# Altium schematic sheet 03 SOC_PORT0~2.SchDoc
size 513 x 386 mm
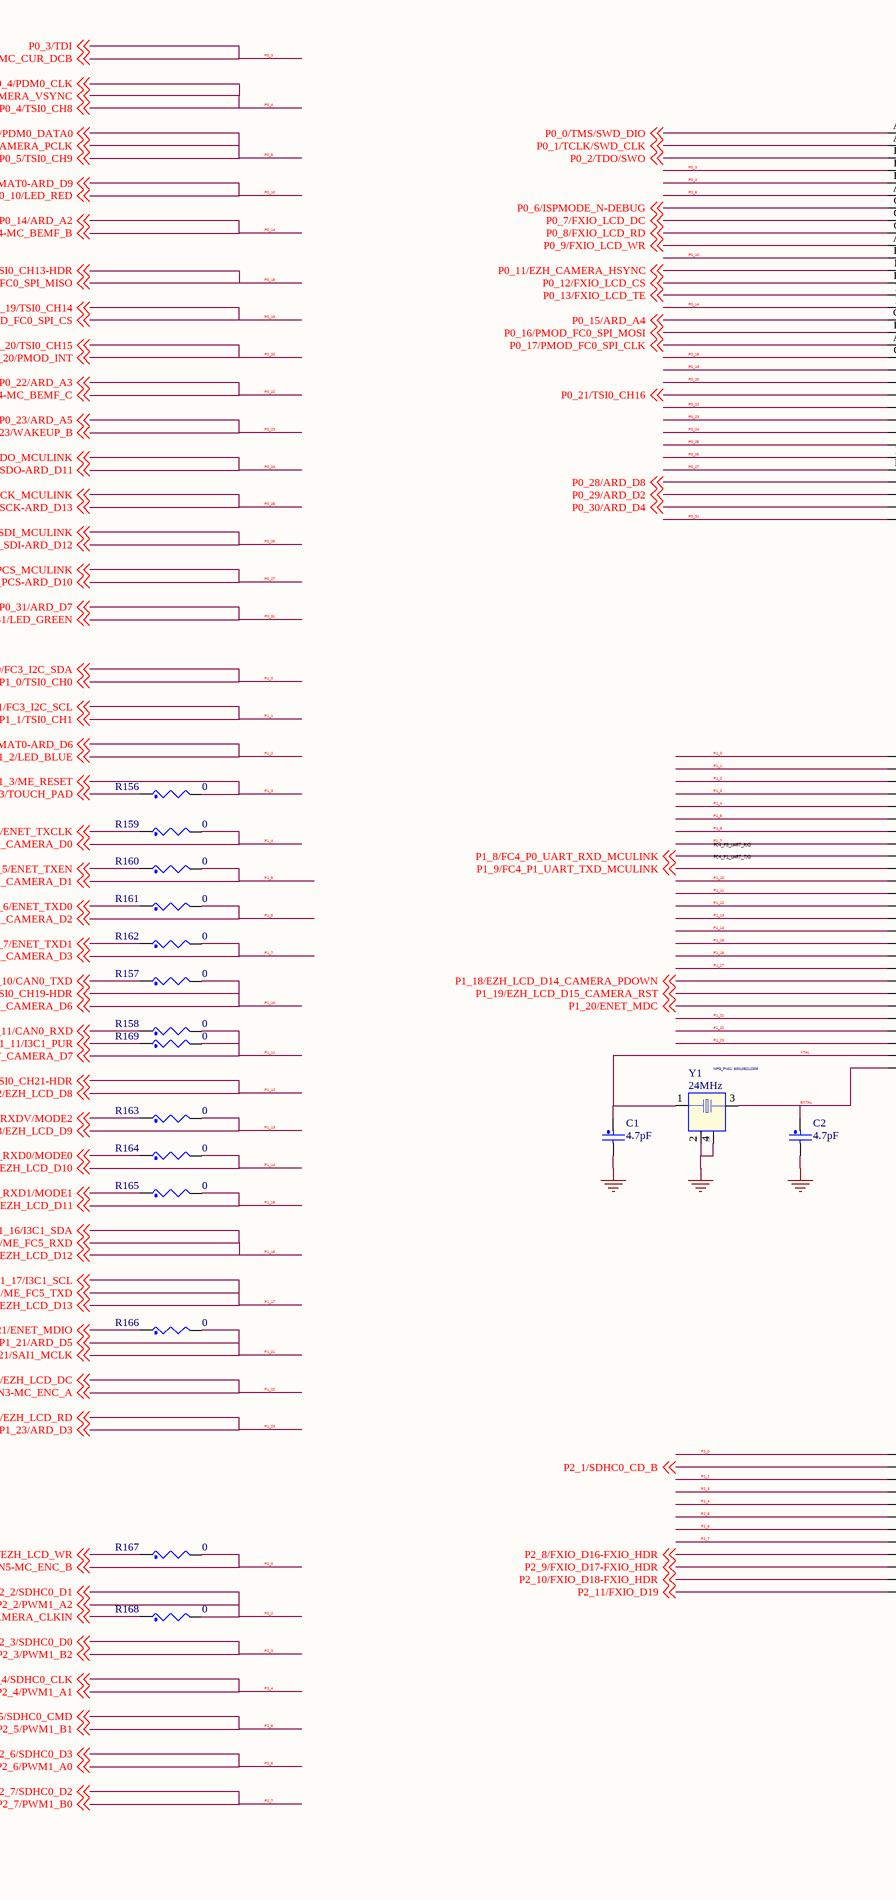
[diagram p0: 03 SOC_PORT0~2.SchDoc, left]
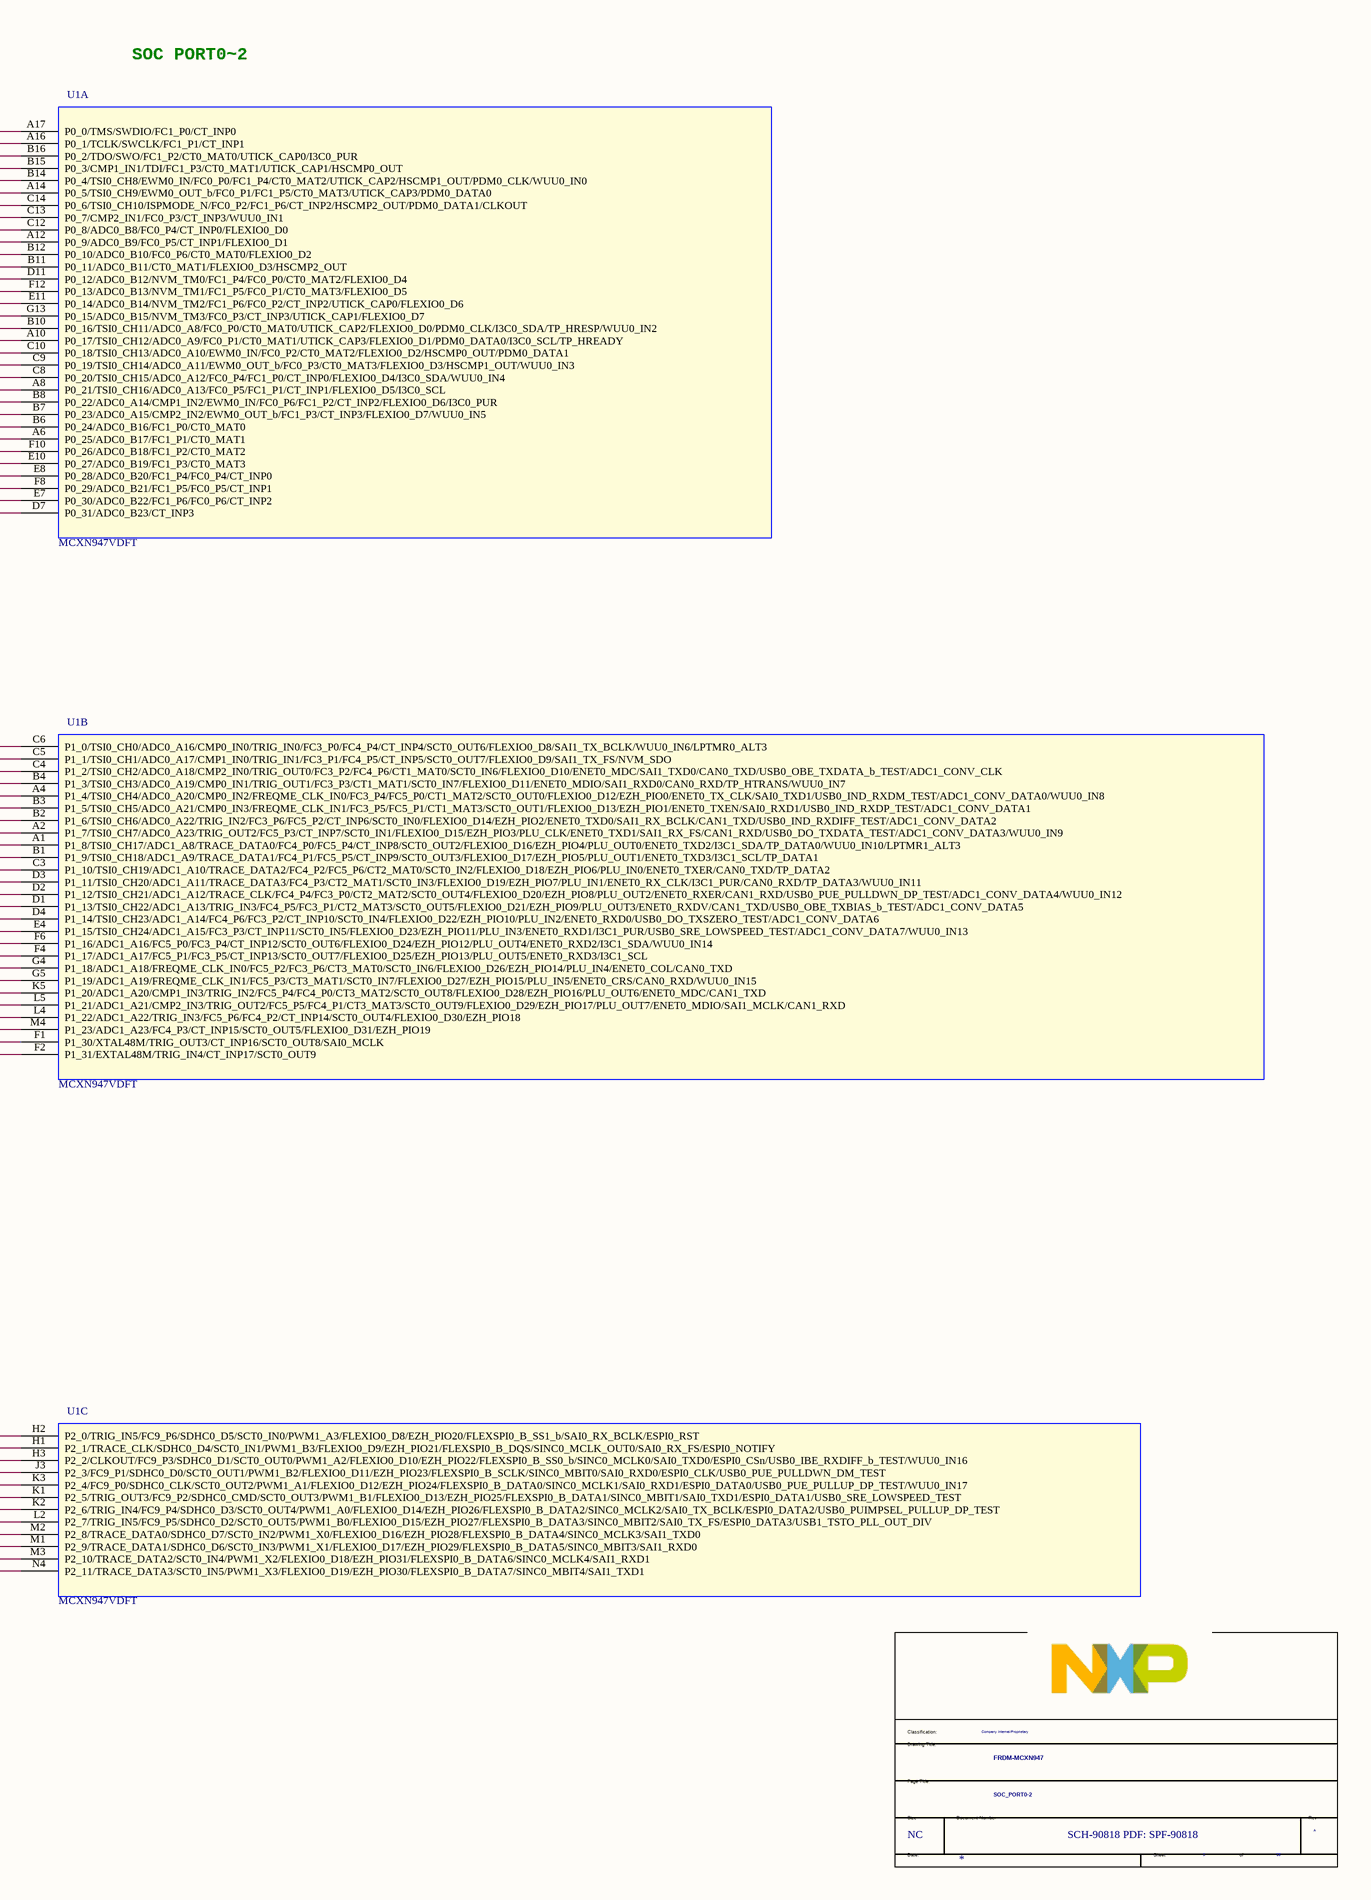
[diagram p1: 03 SOC_PORT0~2.SchDoc, right]

## Parts
*  Doc: SCH-90818 PDF: SPF-90818  RevCode: A  Title: FRDM-MCXN947  Page Size: NC  Page Number: 3  Page Count: 13  PageTitle: SOC_PORT0-2  Classification: Company Internal/Proprietary  (hidden comment: TitleBlock_FS)  (graphical)
C1  4.7pF  [CC0402_25]
C2  4.7pF  [CC0402_25]
R156  0  [RC0603_OV]
R157  0  [RC0603_OV]
R158  0  [RC0603_OV]
R159  0  [RC0603_OV]
R160  0  [RC0603_OV]
R161  0  [RC0603_OV]
R162  0  [RC0603_OV]
R163  0  [RC0603_OV]
R164  0  [RC0603_OV]
R165  0  [RC0603_OV]
R166  0  [RC0603_OV]
R167  0  [RC0402_25]
R168  0  [RC0603_OV]
R169  0  [RC0402_25]
U1  MCXN947VDFT  [bga184_0p5_9x9_sm]  (parts A,B,C of 8)
Y1  24MHz  MFG_PN01: 830108212309  [xtal4_2p1x1p7mm_sm]

## Nets
GND: C1.2 C2.2 Y1.2(GND1) Y1.4(GND2)
EXTAL: C2.1 U1.F2(P1_31/EXTAL48M/TRIG_IN4/CT_INP17/SCT0_OUT9) Y1.3
P0_0/TMS/SWD_DIO: U1.A17(P0_0/TMS/SWDIO/FC1_P0/CT_INP0) ; off-sheet P0_0/TMS/SWD_DIO
P0_1/TCLK/SWD_CLK: U1.A16(P0_1/TCLK/SWCLK/FC1_P1/CT_INP1) ; off-sheet P0_1/TCLK/SWD_CLK
P0_2/TDO/SWO: U1.B16(P0_2/TDO/SWO/FC1_P2/CT0_MAT0/UTICK_CAP0/I3C0_PUR) ; off-sheet P0_2/TDO/SWO
P0_3: U1.B15(P0_3/CMP1_IN1/TDI/FC1_P3/CT0_MAT1/UTICK_CAP1/HSCMP0_OUT) ; off-sheet P0_3/CMP1_IN1-MC_CUR_DCB, off-sheet P0_3/TDI  [also labelled P0_3/CMP1_IN1-MC_CUR_DCB, P0_3/TDI]
P0_4: U1.B14(P0_4/TSI0_CH8/EWM0_IN/FC0_P0/FC1_P4/CT0_MAT2/UTICK_CAP2/HSCMP1_OUT/PDM0_CLK/WUU0_IN0) ; off-sheet P0_4/TSI0_CH8, off-sheet P0_4/PDM0_CLK, off-sheet P0_4/EZH_CAMERA_VSYNC  [also labelled P0_4/EZH_CAMERA_VSYNC, P0_4/PDM0_CLK, P0_4/TSI0_CH8]
P0_5: U1.A14(P0_5/TSI0_CH9/EWM0_OUT_b/FC0_P1/FC1_P5/CT0_MAT3/UTICK_CAP3/PDM0_DATA0) ; off-sheet P0_5/EZH_CAMERA_PCLK, off-sheet P0_5/PDM0_DATA0, off-sheet P0_5/TSI0_CH9  [also labelled P0_5/EZH_CAMERA_PCLK, P0_5/PDM0_DATA0, P0_5/TSI0_CH9]
P0_6/ISPMODE_N-DEBUG: U1.C14(P0_6/TSI0_CH10/ISPMODE_N/FC0_P2/FC1_P6/CT_INP2/HSCMP2_OUT/PDM0_DATA1/CLKOUT) ; off-sheet P0_6/ISPMODE_N-DEBUG
P0_7/FXIO_LCD_DC: U1.C13(P0_7/CMP2_IN1/FC0_P3/CT_INP3/WUU0_IN1) ; off-sheet P0_7/FXIO_LCD_DC
P0_8/FXIO_LCD_RD: U1.C12(P0_8/ADC0_B8/FC0_P4/CT_INP0/FLEXIO0_D0) ; off-sheet P0_8/FXIO_LCD_RD
P0_9/FXIO_LCD_WR: U1.A12(P0_9/ADC0_B9/FC0_P5/CT_INP1/FLEXIO0_D1) ; off-sheet P0_9/FXIO_LCD_WR
P0_10: U1.B12(P0_10/ADC0_B10/FC0_P6/CT0_MAT0/FLEXIO0_D2) ; off-sheet P0_10/LED_RED, off-sheet P0_10/CT0_MAT0-ARD_D9  [also labelled P0_10/CT0_MAT0-ARD_D9, P0_10/LED_RED]
P0_11/EZH_CAMERA_HSYNC: U1.B11(P0_11/ADC0_B11/CT0_MAT1/FLEXIO0_D3/HSCMP2_OUT) ; off-sheet P0_11/EZH_CAMERA_HSYNC
P0_12/FXIO_LCD_CS: U1.D11(P0_12/ADC0_B12/NVM_TM0/FC1_P4/FC0_P0/CT0_MAT2/FLEXIO0_D4) ; off-sheet P0_12/FXIO_LCD_CS
P0_13/FXIO_LCD_TE: U1.F12(P0_13/ADC0_B13/NVM_TM1/FC1_P5/FC0_P1/CT0_MAT3/FLEXIO0_D5) ; off-sheet P0_13/FXIO_LCD_TE
P0_14: U1.E11(P0_14/ADC0_B14/NVM_TM2/FC1_P6/FC0_P2/CT_INP2/UTICK_CAP0/FLEXIO0_D6) ; off-sheet P0_14/ARD_A2, off-sheet P0_14/ADC0_B14-MC_BEMF_B  [also labelled P0_14/ADC0_B14-MC_BEMF_B, P0_14/ARD_A2]
P0_15/ARD_A4: U1.G13(P0_15/ADC0_B15/NVM_TM3/FC0_P3/CT_INP3/UTICK_CAP1/FLEXIO0_D7) ; off-sheet P0_15/ARD_A4
P0_16/PMOD_FC0_SPI_MOSI: U1.B10(P0_16/TSI0_CH11/ADC0_A8/FC0_P0/CT0_MAT0/UTICK_CAP2/FLEXIO0_D0/PDM0_CLK/I3C0_SDA/TP_HRESP/WUU0_IN2) ; off-sheet P0_16/PMOD_FC0_SPI_MOSI
P0_17/PMOD_FC0_SPI_CLK: U1.A10(P0_17/TSI0_CH12/ADC0_A9/FC0_P1/CT0_MAT1/UTICK_CAP3/FLEXIO0_D1/PDM0_DATA0/I3C0_SCL/TP_HREADY) ; off-sheet P0_17/PMOD_FC0_SPI_CLK
P0_18: U1.C10(P0_18/TSI0_CH13/ADC0_A10/EWM0_IN/FC0_P2/CT0_MAT2/FLEXIO0_D2/HSCMP0_OUT/PDM0_DATA1) ; off-sheet P0_18/TSI0_CH13-HDR, off-sheet P0_18/PMOD_FC0_SPI_MISO  [also labelled P0_18/PMOD_FC0_SPI_MISO, P0_18/TSI0_CH13-HDR]
P0_19: U1.C9(P0_19/TSI0_CH14/ADC0_A11/EWM0_OUT_b/FC0_P3/CT0_MAT3/FLEXIO0_D3/HSCMP1_OUT/WUU0_IN3) ; off-sheet P0_19/TSI0_CH14, off-sheet P0_19/PMOD_FC0_SPI_CS  [also labelled P0_19/PMOD_FC0_SPI_CS, P0_19/TSI0_CH14]
P0_20: U1.C8(P0_20/TSI0_CH15/ADC0_A12/FC0_P4/FC1_P0/CT_INP0/FLEXIO0_D4/I3C0_SDA/WUU0_IN4) ; off-sheet P0_20/TSI0_CH15, off-sheet P0_20/PMOD_INT  [also labelled P0_20/PMOD_INT, P0_20/TSI0_CH15]
P0_21/TSI0_CH16: U1.A8(P0_21/TSI0_CH16/ADC0_A13/FC0_P5/FC1_P1/CT_INP1/FLEXIO0_D5/I3C0_SCL) ; off-sheet P0_21/TSI0_CH16
P0_22: U1.B8(P0_22/ADC0_A14/CMP1_IN2/EWM0_IN/FC0_P6/FC1_P2/CT_INP2/FLEXIO0_D6/I3C0_PUR) ; off-sheet P0_22/ARD_A3, off-sheet P0_22/ADC0_A14-MC_BEMF_C  [also labelled P0_22/ADC0_A14-MC_BEMF_C, P0_22/ARD_A3]
P0_23: U1.B7(P0_23/ADC0_A15/CMP2_IN2/EWM0_OUT_b/FC1_P3/CT_INP3/FLEXIO0_D7/WUU0_IN5) ; off-sheet P0_23/WAKEUP_B, off-sheet P0_23/ARD_A5  [also labelled P0_23/ARD_A5, P0_23/WAKEUP_B]
P0_24: U1.B6(P0_24/ADC0_B16/FC1_P0/CT0_MAT0) ; off-sheet P0_24/FC1_SPI_SDO_MCULINK, off-sheet P0_24/FC1_SPI_SDO-ARD_D11  [also labelled P0_24/FC1_SPI_SDO-ARD_D11, P0_24/FC1_SPI_SDO_MCULINK]
P0_25: U1.A6(P0_25/ADC0_B17/FC1_P1/CT0_MAT1) ; off-sheet P0_25/FCI_SPI_SCK_MCULINK, off-sheet P0_25/FCI_SPI_SCK-ARD_D13  [also labelled P0_25/FCI_SPI_SCK-ARD_D13, P0_25/FCI_SPI_SCK_MCULINK]
P0_26: U1.F10(P0_26/ADC0_B18/FC1_P2/CT0_MAT2) ; off-sheet P0_26/FC1_SPI_SDI_MCULINK, off-sheet P0_26/FC1_SPI_SDI-ARD_D12  [also labelled P0_26/FC1_SPI_SDI-ARD_D12, P0_26/FC1_SPI_SDI_MCULINK]
P0_27: U1.E10(P0_27/ADC0_B19/FC1_P3/CT0_MAT3) ; off-sheet P0_27/FC1_SPI_PCS_MCULINK, off-sheet P0_27/FC1_SPI_PCS-ARD_D10  [also labelled P0_27/FC1_SPI_PCS-ARD_D10, P0_27/FC1_SPI_PCS_MCULINK]
P0_28/ARD_D8: U1.E8(P0_28/ADC0_B20/FC1_P4/FC0_P4/CT_INP0) ; off-sheet P0_28/ARD_D8
P0_29/ARD_D2: U1.F8(P0_29/ADC0_B21/FC1_P5/FC0_P5/CT_INP1) ; off-sheet P0_29/ARD_D2
P0_30/ARD_D4: U1.E7(P0_30/ADC0_B22/FC1_P6/FC0_P6/CT_INP2) ; off-sheet P0_30/ARD_D4
P0_31: U1.D7(P0_31/ADC0_B23/CT_INP3) ; off-sheet P0_31/LED_GREEN, off-sheet P0_31/ARD_D7  [also labelled P0_31/ARD_D7, P0_31/LED_GREEN]
P1_0: U1.C6(P1_0/TSI0_CH0/ADC0_A16/CMP0_IN0/TRIG_IN0/FC3_P0/FC4_P4/CT_INP4/SCT0_OUT6/FLEXIO0_D8/SAI1_TX_BCLK/WUU0_IN6/LPTMR0_ALT3) ; off-sheet P1_0/FC3_I2C_SDA, off-sheet P1_0/TSI0_CH0  [also labelled P1_0/FC3_I2C_SDA, P1_0/TSI0_CH0]
P1_1: U1.C5(P1_1/TSI0_CH1/ADC0_A17/CMP1_IN0/TRIG_IN1/FC3_P1/FC4_P5/CT_INP5/SCT0_OUT7/FLEXIO0_D9/SAI1_TX_FS/NVM_SDO) ; off-sheet P1_1/FC3_I2C_SCL, off-sheet P1_1/TSI0_CH1  [also labelled P1_1/FC3_I2C_SCL, P1_1/TSI0_CH1]
P1_2: U1.C4(P1_2/TSI0_CH2/ADC0_A18/CMP2_IN0/TRIG_OUT0/FC3_P2/FC4_P6/CT1_MAT0/SCT0_IN6/FLEXIO0_D10/ENET0_MDC/SAI1_TXD0/CAN0_TXD/USB0_OBE_TXDATA_b_TEST/ADC1_CONV_CLK) ; off-sheet P1_2/LED_BLUE, off-sheet P1_2/CT1_MAT0-ARD_D6  [also labelled P1_2/CT1_MAT0-ARD_D6, P1_2/LED_BLUE]
P1_3: R156.2 U1.B4(P1_3/TSI0_CH3/ADC0_A19/CMP0_IN1/TRIG_OUT1/FC3_P3/CT1_MAT1/SCT0_IN7/FLEXIO0_D11/ENET0_MDIO/SAI1_RXD0/CAN0_RXD/TP_HTRANS/WUU0_IN7) ; off-sheet P1_3/ME_RESET  [also labelled P1_3/ME_RESET]
P1_3/TOUCH_PAD: R156.1 ; off-sheet P1_3/TOUCH_PAD
P1_4: R159.2 U1.A4(P1_4/TSI0_CH4/ADC0_A20/CMP0_IN2/FREQME_CLK_IN0/FC3_P4/FC5_P0/CT1_MAT2/SCT0_OUT0/FLEXIO0_D12/EZH_PIO0/ENET0_TX_CLK/SAI0_TXD1/USB0_IND_RXDM_TEST/ADC1_CONV_DATA0/WUU0_IN8) ; off-sheet P1_4/EZH_LCD_D0_CAMERA_D0  [also labelled P1_4/EZH_LCD_D0_CAMERA_D0]
P1_4/ENET_TXCLK: R159.1 ; off-sheet P1_4/ENET_TXCLK
P1_5: R160.2 U1.B3(P1_5/TSI0_CH5/ADC0_A21/CMP0_IN3/FREQME_CLK_IN1/FC3_P5/FC5_P1/CT1_MAT3/SCT0_OUT1/FLEXIO0_D13/EZH_PIO1/ENET0_TXEN/SAI0_RXD1/USB0_IND_RXDP_TEST/ADC1_CONV_DATA1) ; off-sheet P1_5/EZH_LCD_D1_CAMERA_D1  [also labelled P1_5/EZH_LCD_D1_CAMERA_D1]
P1_5/ENET_TXEN: R160.1 ; off-sheet P1_5/ENET_TXEN
P1_6: R161.2 U1.B2(P1_6/TSI0_CH6/ADC0_A22/TRIG_IN2/FC3_P6/FC5_P2/CT_INP6/SCT0_IN0/FLEXIO0_D14/EZH_PIO2/ENET0_TXD0/SAI1_RX_BCLK/CAN1_TXD/USB0_IND_RXDIFF_TEST/ADC1_CONV_DATA2) ; off-sheet P1_6/EZH_LCD_D2_CAMERA_D2  [also labelled P1_6/EZH_LCD_D2_CAMERA_D2]
P1_6/ENET_TXD0: R161.1 ; off-sheet P1_6/ENET_TXD0
P1_7: R162.2 U1.A2(P1_7/TSI0_CH7/ADC0_A23/TRIG_OUT2/FC5_P3/CT_INP7/SCT0_IN1/FLEXIO0_D15/EZH_PIO3/PLU_CLK/ENET0_TXD1/SAI1_RX_FS/CAN1_RXD/USB0_DO_TXDATA_TEST/ADC1_CONV_DATA3/WUU0_IN9) ; off-sheet P1_7/EZH_LCD_D3_CAMERA_D3  [also labelled P1_7/EZH_LCD_D3_CAMERA_D3]
P1_7/ENET_TXD1: R162.1 ; off-sheet P1_7/ENET_TXD1
P1_8/FC4_P0_UART_RXD_MCULINK: U1.A1(P1_8/TSI0_CH17/ADC1_A8/TRACE_DATA0/FC4_P0/FC5_P4/CT_INP8/SCT0_OUT2/FLEXIO0_D16/EZH_PIO4/PLU_OUT0/ENET0_TXD2/I3C1_SDA/TP_DATA0/WUU0_IN10/LPTMR1_ALT3) ; off-sheet P1_8/FC4_P0_UART_RXD_MCULINK
P1_9/FC4_P1_UART_TXD_MCULINK: U1.B1(P1_9/TSI0_CH18/ADC1_A9/TRACE_DATA1/FC4_P1/FC5_P5/CT_INP9/SCT0_OUT3/FLEXIO0_D17/EZH_PIO5/PLU_OUT1/ENET0_TXD3/I3C1_SCL/TP_DATA1) ; off-sheet P1_9/FC4_P1_UART_TXD_MCULINK
P1_10: R157.2 U1.C3(P1_10/TSI0_CH19/ADC1_A10/TRACE_DATA2/FC4_P2/FC5_P6/CT2_MAT0/SCT0_IN2/FLEXIO0_D18/EZH_PIO6/PLU_IN0/ENET0_TXER/CAN0_TXD/TP_DATA2) ; off-sheet P1_10/EZH_LCD_D6_CAMERA_D6, off-sheet P1_10/TSI0_CH19-HDR  [also labelled P1_10/EZH_LCD_D6_CAMERA_D6, P1_10/TSI0_CH19-HDR]
P1_10/CAN0_TXD: R157.1 ; off-sheet P1_10/CAN0_TXD
P1_11: R158.2 R169.2 U1.D3(P1_11/TSI0_CH20/ADC1_A11/TRACE_DATA3/FC4_P3/CT2_MAT1/SCT0_IN3/FLEXIO0_D19/EZH_PIO7/PLU_IN1/ENET0_RX_CLK/I3C1_PUR/CAN0_RXD/TP_DATA3/WUU0_IN11) ; off-sheet P1_11/EZH_LCD_D7_CAMERA_D7  [also labelled P1_11/EZH_LCD_D7_CAMERA_D7]
P1_11/CAN0_RXD: R158.1 ; off-sheet P1_11/CAN0_RXD
P1_11/I3C1_PUR: R169.1 ; off-sheet P1_11/I3C1_PUR
P1_12: U1.D2(P1_12/TSI0_CH21/ADC1_A12/TRACE_CLK/FC4_P4/FC3_P0/CT2_MAT2/SCT0_OUT4/FLEXIO0_D20/EZH_PIO8/PLU_OUT2/ENET0_RXER/CAN1_RXD/USB0_PUE_PULLDWN_DP_TEST/ADC1_CONV_DATA4/WUU0_IN12) ; off-sheet P1_12/EZH_LCD_D8, off-sheet P1_12/TSI0_CH21-HDR  [also labelled P1_12/EZH_LCD_D8, P1_12/TSI0_CH21-HDR]
P1_13: R163.2 U1.D1(P1_13/TSI0_CH22/ADC1_A13/TRIG_IN3/FC4_P5/FC3_P1/CT2_MAT3/SCT0_OUT5/FLEXIO0_D21/EZH_PIO9/PLU_OUT3/ENET0_RXDV/CAN1_TXD/USB0_OBE_TXBIAS_b_TEST/ADC1_CONV_DATA5) ; off-sheet P1_13/EZH_LCD_D9  [also labelled P1_13/EZH_LCD_D9]
P1_13/ENET_RXDV/MODE2: R163.1 ; off-sheet P1_13/ENET_RXDV/MODE2
P1_14: R164.2 U1.D4(P1_14/TSI0_CH23/ADC1_A14/FC4_P6/FC3_P2/CT_INP10/SCT0_IN4/FLEXIO0_D22/EZH_PIO10/PLU_IN2/ENET0_RXD0/USB0_DO_TXSZERO_TEST/ADC1_CONV_DATA6) ; off-sheet P1_14/EZH_LCD_D10  [also labelled P1_14/EZH_LCD_D10]
P1_14/ENET_RXD0/MODE0: R164.1 ; off-sheet P1_14/ENET_RXD0/MODE0
P1_15: R165.2 U1.E4(P1_15/TSI0_CH24/ADC1_A15/FC3_P3/CT_INP11/SCT0_IN5/FLEXIO0_D23/EZH_PIO11/PLU_IN3/ENET0_RXD1/I3C1_PUR/USB0_SRE_LOWSPEED_TEST/ADC1_CONV_DATA7/WUU0_IN13) ; off-sheet P1_15/EZH_LCD_D11  [also labelled P1_15/EZH_LCD_D11]
P1_15/ENET_RXD1/MODE1: R165.1 ; off-sheet P1_15/ENET_RXD1/MODE1
P1_16: U1.F6(P1_16/ADC1_A16/FC5_P0/FC3_P4/CT_INP12/SCT0_OUT6/FLEXIO0_D24/EZH_PIO12/PLU_OUT4/ENET0_RXD2/I3C1_SDA/WUU0_IN14) ; off-sheet P1_16/I3C1_SDA, off-sheet P1_16/ME_FC5_RXD, off-sheet P1_16/EZH_LCD_D12  [also labelled P1_16/EZH_LCD_D12, P1_16/I3C1_SDA, P1_16/ME_FC5_RXD]
P1_17: U1.F4(P1_17/ADC1_A17/FC5_P1/FC3_P5/CT_INP13/SCT0_OUT7/FLEXIO0_D25/EZH_PIO13/PLU_OUT5/ENET0_RXD3/I3C1_SCL) ; off-sheet P1_17/I3C1_SCL, off-sheet P1_17/ME_FC5_TXD, off-sheet P1_17/EZH_LCD_D13  [also labelled P1_17/EZH_LCD_D13, P1_17/I3C1_SCL, P1_17/ME_FC5_TXD]
P1_18/EZH_LCD_D14_CAMERA_PDOWN: U1.G4(P1_18/ADC1_A18/FREQME_CLK_IN0/FC5_P2/FC3_P6/CT3_MAT0/SCT0_IN6/FLEXIO0_D26/EZH_PIO14/PLU_IN4/ENET0_COL/CAN0_TXD) ; off-sheet P1_18/EZH_LCD_D14_CAMERA_PDOWN
P1_19/EZH_LCD_D15_CAMERA_RST: U1.G5(P1_19/ADC1_A19/FREQME_CLK_IN1/FC5_P3/CT3_MAT1/SCT0_IN7/FLEXIO0_D27/EZH_PIO15/PLU_IN5/ENET0_CRS/CAN0_RXD/WUU0_IN15) ; off-sheet P1_19/EZH_LCD_D15_CAMERA_RST
P1_20/ENET_MDC: U1.K5(P1_20/ADC1_A20/CMP1_IN3/TRIG_IN2/FC5_P4/FC4_P0/CT3_MAT2/SCT0_OUT8/FLEXIO0_D28/EZH_PIO16/PLU_OUT6/ENET0_MDC/CAN1_TXD) ; off-sheet P1_20/ENET_MDC
P1_21: R166.2 U1.L5(P1_21/ADC1_A21/CMP2_IN3/TRIG_OUT2/FC5_P5/FC4_P1/CT3_MAT3/SCT0_OUT9/FLEXIO0_D29/EZH_PIO17/PLU_OUT7/ENET0_MDIO/SAI1_MCLK/CAN1_RXD) ; off-sheet P1_21/ARD_D5, off-sheet P1_21/SAI1_MCLK  [also labelled P1_21/ARD_D5, P1_21/SAI1_MCLK]
P1_21/ENET_MDIO: R166.1 ; off-sheet P1_21/ENET_MDIO
P1_22: U1.L4(P1_22/ADC1_A22/TRIG_IN3/FC5_P6/FC4_P2/CT_INP14/SCT0_OUT4/FLEXIO0_D30/EZH_PIO18) ; off-sheet P1_22/EZH_LCD_DC, off-sheet P1_22/TRIG_IN3-MC_ENC_A  [also labelled P1_22/EZH_LCD_DC, P1_22/TRIG_IN3-MC_ENC_A]
P1_23: U1.M4(P1_23/ADC1_A23/FC4_P3/CT_INP15/SCT0_OUT5/FLEXIO0_D31/EZH_PIO19) ; off-sheet P1_23/EZH_LCD_RD, off-sheet P1_23/ARD_D3  [also labelled P1_23/ARD_D3, P1_23/EZH_LCD_RD]
P2_0: R167.2 U1.H2(P2_0/TRIG_IN5/FC9_P6/SDHC0_D5/SCT0_IN0/PWM1_A3/FLEXIO0_D8/EZH_PIO20/FLEXSPI0_B_SS1_b/SAI0_RX_BCLK/ESPI0_RST) ; off-sheet P2_0/TRIG_IN5-MC_ENC_B  [also labelled P2_0/TRIG_IN5-MC_ENC_B]
P2_0/EZH_LCD_WR: R167.1 ; off-sheet P2_0/EZH_LCD_WR
P2_1/SDHC0_CD_B: U1.H1(P2_1/TRACE_CLK/SDHC0_D4/SCT0_IN1/PWM1_B3/FLEXIO0_D9/EZH_PIO21/FLEXSPI0_B_DQS/SINC0_MCLK_OUT0/SAI0_RX_FS/ESPI0_NOTIFY) ; off-sheet P2_1/SDHC0_CD_B
P2_2: R168.2 U1.H3(P2_2/CLKOUT/FC9_P3/SDHC0_D1/SCT0_OUT0/PWM1_A2/FLEXIO0_D10/EZH_PIO22/FLEXSPI0_B_SS0_b/SINC0_MCLK0/SAI0_TXD0/ESPI0_CSn/USB0_IBE_RXDIFF_b_TEST/WUU0_IN16) ; off-sheet P2_2/SDHC0_D1, off-sheet P2_2/PWM1_A2  [also labelled P2_2/PWM1_A2, P2_2/SDHC0_D1]
P2_2/CAMERA_CLKIN: R168.1 ; off-sheet P2_2/CAMERA_CLKIN
P2_3: U1.J3(P2_3/FC9_P1/SDHC0_D0/SCT0_OUT1/PWM1_B2/FLEXIO0_D11/EZH_PIO23/FLEXSPI0_B_SCLK/SINC0_MBIT0/SAI0_RXD0/ESPI0_CLK/USB0_PUE_PULLDWN_DM_TEST) ; off-sheet P2_3/SDHC0_D0, off-sheet P2_3/PWM1_B2  [also labelled P2_3/PWM1_B2, P2_3/SDHC0_D0]
P2_4: U1.K3(P2_4/FC9_P0/SDHC0_CLK/SCT0_OUT2/PWM1_A1/FLEXIO0_D12/EZH_PIO24/FLEXSPI0_B_DATA0/SINC0_MCLK1/SAI0_RXD1/ESPI0_DATA0/USB0_PUE_PULLUP_DP_TEST/WUU0_IN17) ; off-sheet P2_4/SDHC0_CLK, off-sheet P2_4/PWM1_A1  [also labelled P2_4/PWM1_A1, P2_4/SDHC0_CLK]
P2_5: U1.K1(P2_5/TRIG_OUT3/FC9_P2/SDHC0_CMD/SCT0_OUT3/PWM1_B1/FLEXIO0_D13/EZH_PIO25/FLEXSPI0_B_DATA1/SINC0_MBIT1/SAI0_TXD1/ESPI0_DATA1/USB0_SRE_LOWSPEED_TEST) ; off-sheet P2_5/SDHC0_CMD, off-sheet P2_5/PWM1_B1  [also labelled P2_5/PWM1_B1, P2_5/SDHC0_CMD]
P2_6: U1.K2(P2_6/TRIG_IN4/FC9_P4/SDHC0_D3/SCT0_OUT4/PWM1_A0/FLEXIO0_D14/EZH_PIO26/FLEXSPI0_B_DATA2/SINC0_MCLK2/SAI0_TX_BCLK/ESPI0_DATA2/USB0_PUIMPSEL_PULLUP_DP_TEST) ; off-sheet P2_6/SDHC0_D3, off-sheet P2_6/PWM1_A0  [also labelled P2_6/PWM1_A0, P2_6/SDHC0_D3]
P2_7: U1.L2(P2_7/TRIG_IN5/FC9_P5/SDHC0_D2/SCT0_OUT5/PWM1_B0/FLEXIO0_D15/EZH_PIO27/FLEXSPI0_B_DATA3/SINC0_MBIT2/SAI0_TX_FS/ESPI0_DATA3/USB1_TSTO_PLL_OUT_DIV) ; off-sheet P2_7/SDHC0_D2, off-sheet P2_7/PWM1_B0  [also labelled P2_7/PWM1_B0, P2_7/SDHC0_D2]
P2_8/FXIO_D16-FXIO_HDR: U1.M2(P2_8/TRACE_DATA0/SDHC0_D7/SCT0_IN2/PWM1_X0/FLEXIO0_D16/EZH_PIO28/FLEXSPI0_B_DATA4/SINC0_MCLK3/SAI1_TXD0) ; off-sheet P2_8/FXIO_D16-FXIO_HDR
P2_9/FXIO_D17-FXIO_HDR: U1.M1(P2_9/TRACE_DATA1/SDHC0_D6/SCT0_IN3/PWM1_X1/FLEXIO0_D17/EZH_PIO29/FLEXSPI0_B_DATA5/SINC0_MBIT3/SAI1_RXD0) ; off-sheet P2_9/FXIO_D17-FXIO_HDR
P2_10/FXIO_D18-FXIO_HDR: U1.M3(P2_10/TRACE_DATA2/SCT0_IN4/PWM1_X2/FLEXIO0_D18/EZH_PIO31/FLEXSPI0_B_DATA6/SINC0_MCLK4/SAI1_RXD1) ; off-sheet P2_10/FXIO_D18-FXIO_HDR
P2_11/FXIO_D19: U1.N4(P2_11/TRACE_DATA3/SCT0_IN5/PWM1_X3/FLEXIO0_D19/EZH_PIO30/FLEXSPI0_B_DATA7/SINC0_MBIT4/SAI1_TXD1) ; off-sheet P2_11/FXIO_D19
XTAL: C1.1 U1.F1(P1_30/XTAL48M/TRIG_OUT3/CT_INP16/SCT0_OUT8/SAI0_MCLK) Y1.1

## Notes on the sheet
- SOC PORT0~2
- FC4_P0_UART_RXD
- FC4_P1_UART_TXD
- (in symbol TitleBlock_FS) Classification:; Drawing Title:; Page Title:; Size; Document Number; Rev; Date:; Sheet; of

## Library data of the parts
* = TitleBlock_FS: Classification: Public, Company Internal/Proprietary, Company Confidential,  Company Secret; OrgName: NXP Semiconductors; OrgAddr1: 6501 William Cannon Drive West; OrgAddr2: Austin, TX 78735-8598; Variant Name: <Core Design>; Page Create Date: March  8, 1995; Page Modify Date: *
C1 = CAP_NP: CAP CER 4.7PF 50V 0.5pF C0G 0402; CLASS: DISCRETE; MFG_PN01: 885012005053; MFG_NAME01: Wurth Elektronik; Temp Range: -55C to +125C; CAD_APPROVED: yes; FPLIST: CC0402_25,CC0402_HD,0402_CC,capc0402_l; AGILE_PN: 150-80750; PCB Footprint: CC0402_25; ROHS: yes; Rated Voltage: 50V; Tolerance: 0.5pF; Package Type: SMD/SMT; HEIGHT: 0.5 mm; Package Size: 0402 (1005 metric)
C2 = CAP_NP: CAP CER 4.7PF 50V 0.5pF C0G 0402; CLASS: DISCRETE; AGILE_PN: 150-80750; FPLIST: CC0402_25,CC0402_HD,0402_CC,capc0402_l; CAD_APPROVED: yes; Temp Range: -55C to +125C; MFG_NAME01: Wurth Elektronik; MFG_PN01: 885012005053; PCB Footprint: CC0402_25; Package Size: 0402 (1005 metric); HEIGHT: 0.5 mm; Package Type: SMD/SMT; Tolerance: 0.5pF; Rated Voltage: 50V; ROHS: yes
R156-R158 R160-R165 R168 = RES: RES MF ZERO OHM 1/10W -- 0603; CLASS: DISCRETE; AGILE_PN: 470-80866; FPLIST: RC0603_OV,RC0603,R603-X2,r603-x2_b,0603_CC,IND_0603HP_NSP,CC0603_OV_NSP; CAD_APPROVED: Yes; Temp Range: ¨C55 ¡ãC to +155 ¡ãC; MFG_NAME01: YAGEO AMERICA; MFG_PN01: RC0603FR-070RL; HEIGHT: 0.6MM; ROHS: Yes; PCB Footprint: RC0603_OV
R159 R166 = RES: RES MF ZERO OHM 1/10W -- 0603; CLASS: DISCRETE; MFG_PN01: RC0603FR-070RL; MFG_NAME01: YAGEO AMERICA; Temp Range: ¨C55 ¡ãC to +155 ¡ãC; CAD_APPROVED: Yes; FPLIST: RC0603_OV,RC0603,R603-X2,r603-x2_b,0603_CC,IND_0603HP_NSP,CC0603_OV_NSP; AGILE_PN: 470-80866; ROHS: Yes; HEIGHT: 0.6MM; PCB Footprint: RC0603_OV
R167 R169 = RES: RES MF ZERO OHM 1/16W 5% 0402; CLASS: DISCRETE; AGILE_PN: 470-75394; FPLIST: RC0402_25,RC0402_HD,RC0402_X2,0402_CC,rc0402_lamp3; CAD_APPROVED: Yes; MFG_NAME01: BOURNS; MFG_PN01: CR0402-J/-000GLF; HEIGHT: 0.45 MM; Tolerance: 5%; ROHS: Yes; PCB Footprint: RC0402_25
U1 = MCXN947VDFT_BGA_184P: IC MCU LOW POWER 150MHz ARM Nirvana -- VFBGA184; SPLIT_INST: TRUE; MFG_NAME01: NXP SEMICONDUCTOR; Temp Range: -40  ¡ãC to +105 ¡ãC; PRE_APN: 344-02549; CAD_APPROVED: Yes; AGILE_PN: TMP-CIP-10342; CLASS: IC; 3D_Mechanical_Footprint_File: http://fcl.am.freescale.net/ALLEGRO/step/bga184_0p5_9x9_sm.STEP; MFG_PN01: MCXN947VDFT; ROHS: Yes; HEIGHT: 0.98 MM; Package Size: 9x9; PCB Footprint: bga184_0p5_9x9_sm
Y1 = XTAL_4PIN: XTAL 24MHz 10ppm 8pF SMT; CLASS: IC; AGILE_PN: 230-78677; Frequency Tolerance: ¡À10ppm; CAD_APPROVED: YES; Temp Range: -40¡ãC to +85¡ãC; MFG_NAME01: Wurth Electronics Inc.; HEIGHT: 0.50 MM; ROHS: Yes; 3D_Mechanical_Footprint_File: http://fcl.am.freescale.net/ALLEGRO/step/xtal4_2p1x1p7mm_sm.STEP; PCB Footprint: xtal4_2p1x1p7mm_sm